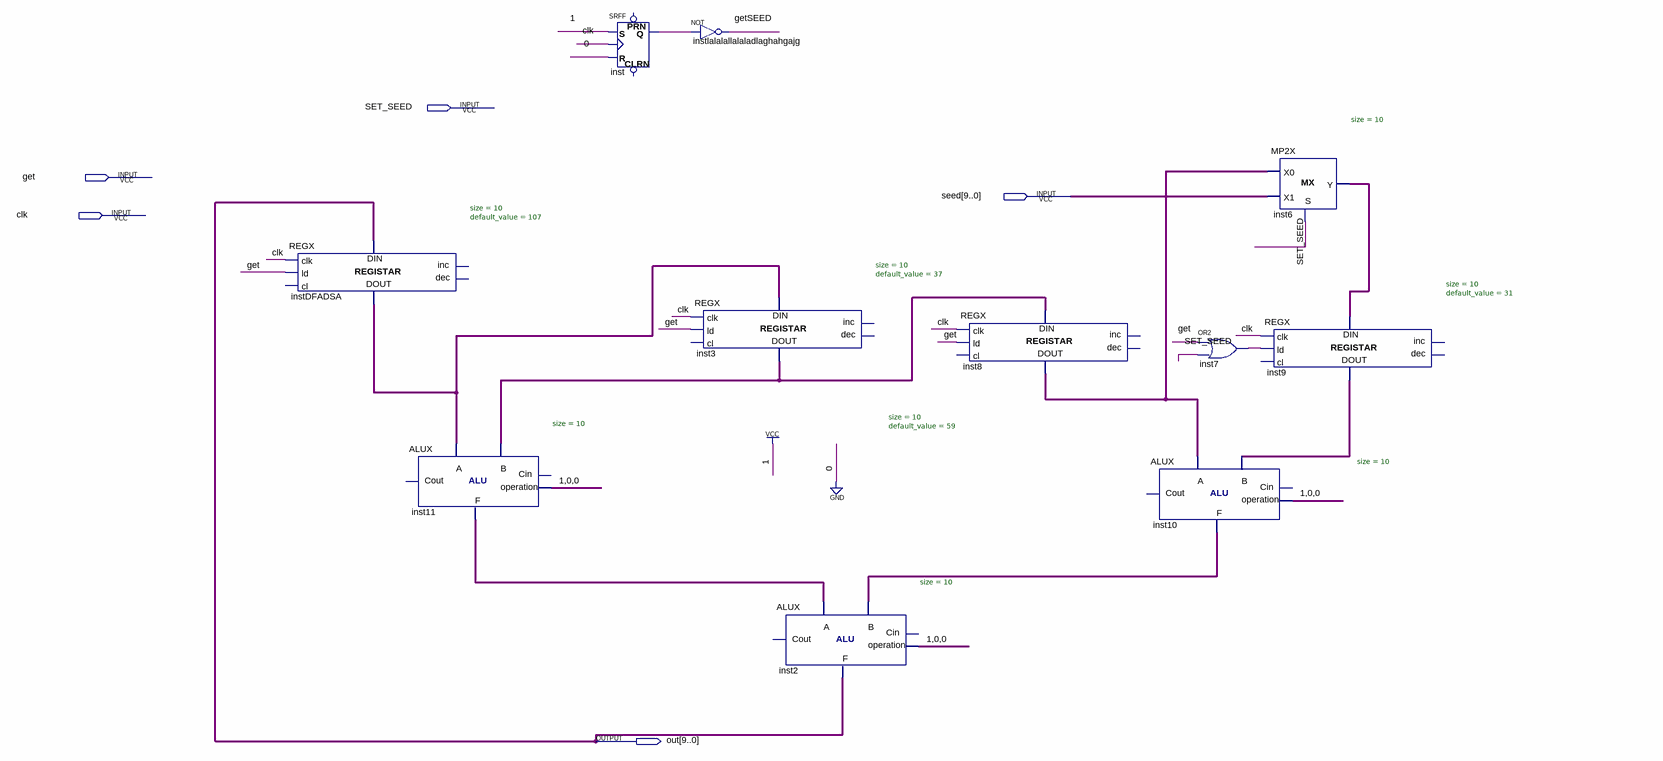
[diagram p0: schematic sheet]
// Quartus schematic RNG.bdf as structural Verilog: 11 symbols, 5 pins
module RNG (
  input  SET_SEED,
  input  get,
  input  [9:0] seed,
  input  clk,
  output [9:0] out
);

  wire getSEED, inst7_out, inst_q;
  wire [9:0] inst3_data_out, inst6_y, inst8_data_out, inst9_data_out, inst10_f, inst11_f, instDFADSA_data_out;

  REGX #(.size(10), .default_value(107)) instDFADSA (
    .clk(clk), .ld(get), .data_in(out), .data_out(instDFADSA_data_out));  // open: cl, inc, dec
  ALUX #(.size(10)) inst11 (.B(inst3_data_out), .A(instDFADSA_data_out), .op(3'b100), .F(inst11_f));  // open: Cin, Cout
  SRFF inst (.S(1'b1), .R(1'b0), .CLK(clk), .Q(inst_q));  // open: PRN, CLRN
  not instlalalallalaladlaghahgajg (getSEED, inst_q);
  REGX #(.size(10), .default_value(37)) inst3 (
    .clk(clk), .ld(get), .data_in(instDFADSA_data_out), .data_out(inst3_data_out));  // open: cl, inc, dec
  ALUX #(.size(10)) inst2 (.B(inst10_f), .A(inst11_f), .op(3'b100), .F(out));  // open: Cin, Cout
  REGX #(.size(10), .default_value(59)) inst8 (
    .clk(clk), .ld(get), .data_in(inst3_data_out), .data_out(inst8_data_out));  // open: cl, inc, dec
  ALUX #(.size(10)) inst10 (.B(inst9_data_out), .A(inst8_data_out), .op(3'b100), .F(inst10_f));  // open: Cin, Cout
  or inst7 (inst7_out, get, SET_SEED);
  MP2X #(.size(10)) inst6 (.S(SET_SEED), .X0(inst8_data_out), .X1(seed), .Y(inst6_y));
  REGX #(.size(10), .default_value(31)) inst9 (
    .clk(clk), .ld(inst7_out), .data_in(inst6_y), .data_out(inst9_data_out));  // open: cl, inc, dec
endmodule
